# EAGLE design rj45-2x5 (EAGLE 6.5.0)
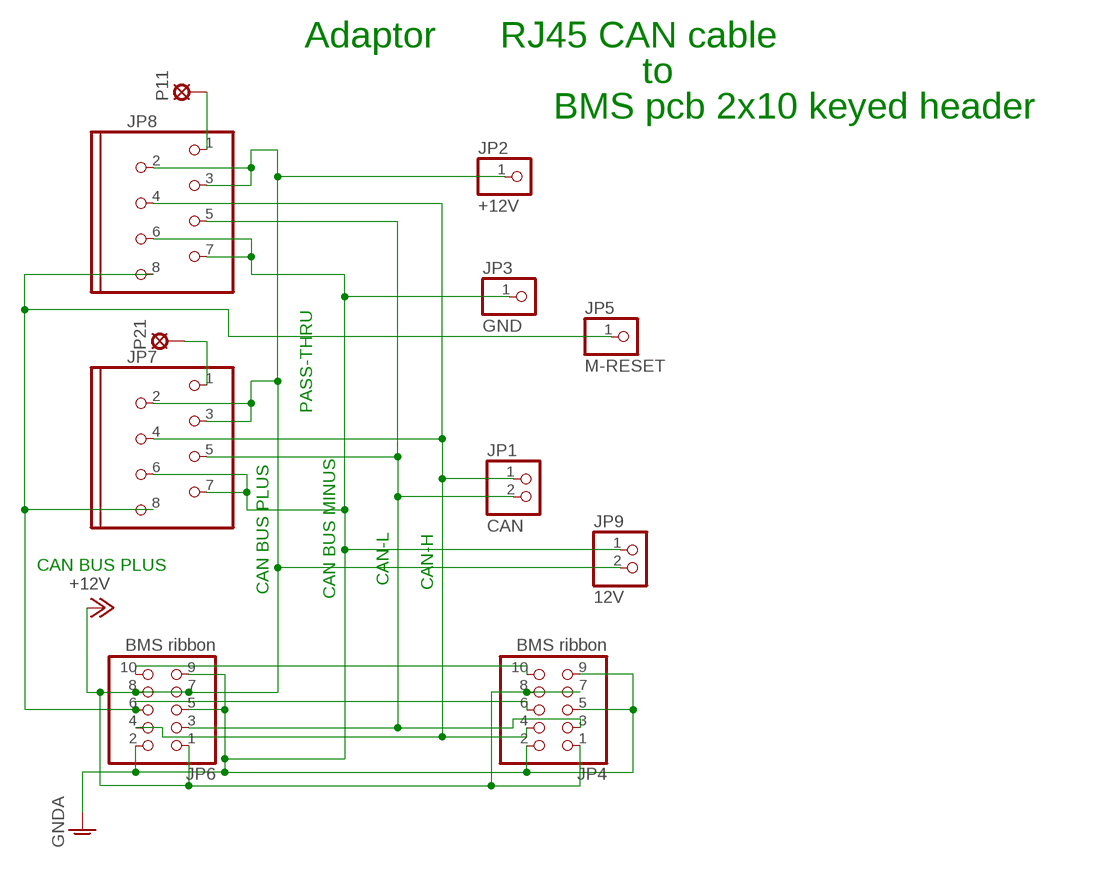
[diagram p0: schematic, sheet 1]

## Parts
JP1  CAN  PINHD-1X2  [1X02]
JP2  +12V  PINHD-1X1  [1X01]
JP3  GND  PINHD-1X1  [1X01]
JP4  BMS ribbon  PINHD-2X5_KEYED  [2X05_KEYED]
JP5  M-RESET  PINHD-1X1  [1X01]
JP6  BMS ribbon  PINHD-2X5_KEYED  [2X05_KEYED]
JP7  MOD8P8C  [MOD8P8C]
JP8  MOD8P8C  [MOD8P8C]
JP9  12V  PINHD-1X2  [1X02]
P11  SOLPAD035  [SOLDPAD035]
P21  SOLPAD035  [SOLDPAD035]

## Nets
+12V: JP2.1 JP4.1 JP4.7 JP4.8 JP6.1 JP6.7 JP6.8 JP7.2 JP7.3 JP8.2 JP8.3 JP9.2
CANCABLE_1_1: JP8.1 P11.MP
CANCABLE_2_1: JP7.1 P21.MP
CANH: JP1.1 JP4.4 JP6.4 JP7.4 JP8.4
CANL: JP1.2 JP4.3 JP6.3 JP7.5 JP8.5
GNDA: JP3.1 JP4.2 JP4.5 JP4.9 JP6.2 JP6.5 JP6.9 JP7.6 JP7.7 JP8.6 JP8.7 JP9.1
MASTER-RESET-SYS: JP4.6 JP5.1 JP6.6 JP7.8 JP8.8
N$2: JP4.10 JP6.10

## Notes on the sheet
- Adaptor | RJ45 CAN cable
- to
- BMS pcb 2x10 keyed header
- PASS-THRU
- CAN BUS PLUS
- CAN-L | CAN-H
- CAN BUS PLUS | CAN BUS MINUS

## Library data of the parts
JP1 JP9 = pinhead:PINHD-1X2: PIN HEADER
JP2 JP3 JP5 = pinhead:PINHD-1X1: PIN HEADER
JP4 JP6 = pinhead:PINHD-2X5_KEYED
JP7 JP8 = DEH:MOD8P8C
P11 P21 = solpad:SOLPAD035

## Board
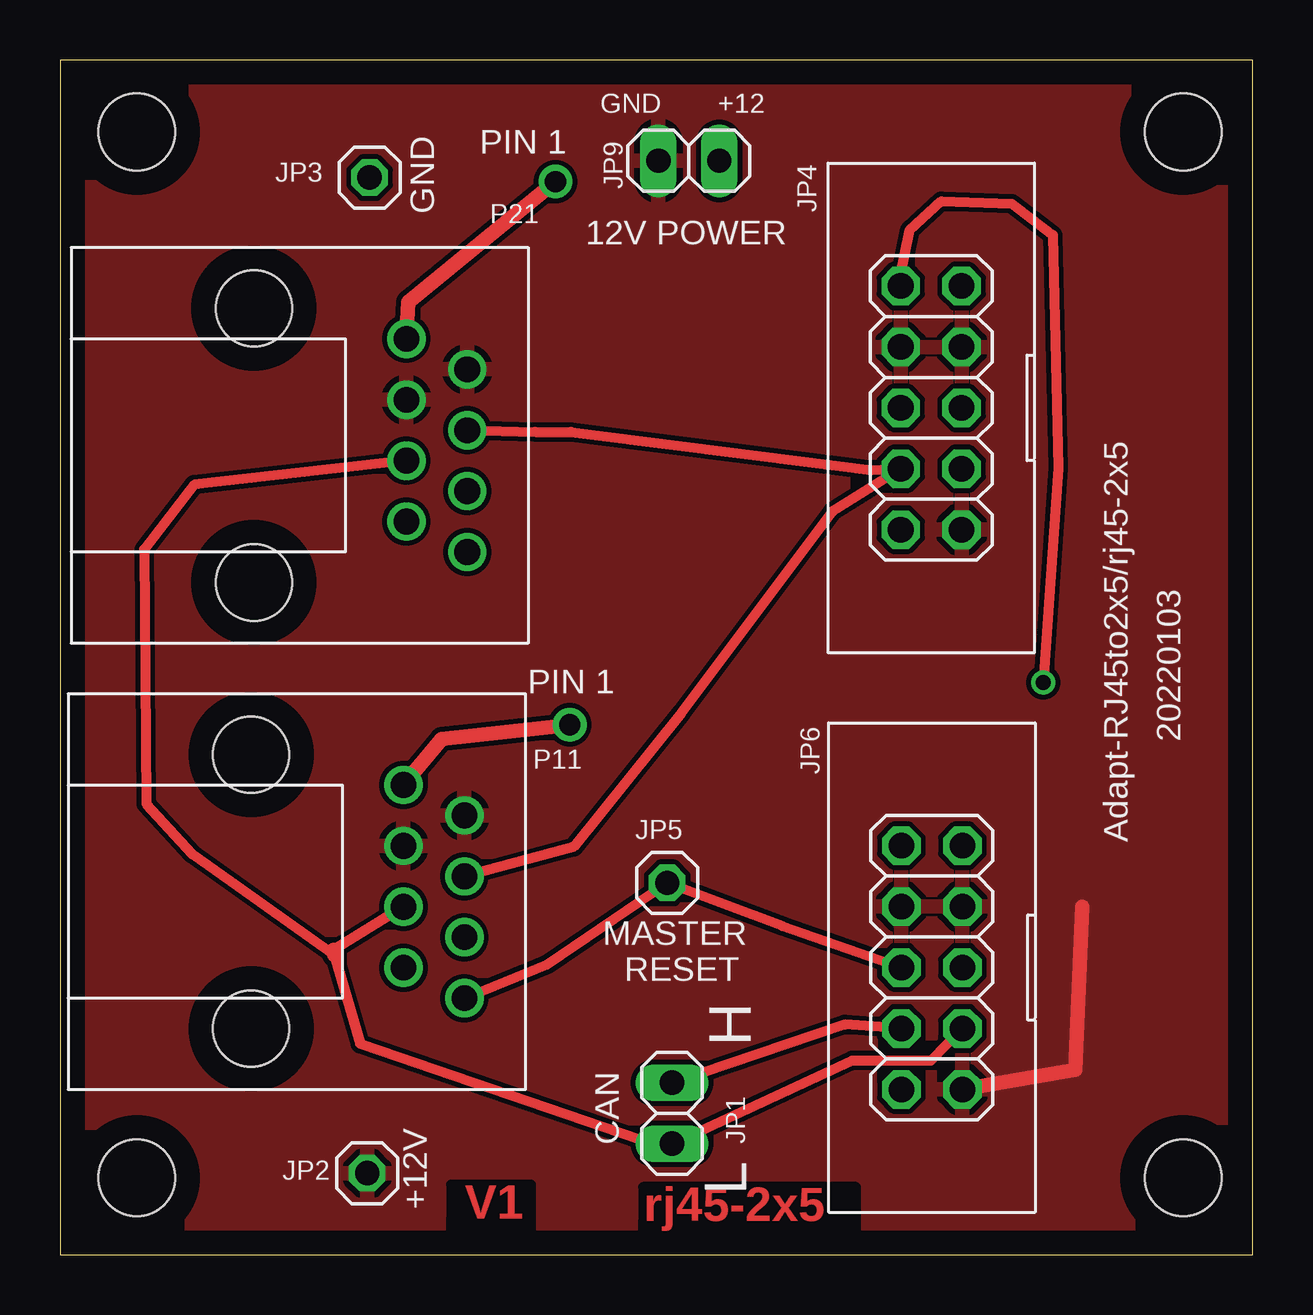
[diagram p1: board, top side]
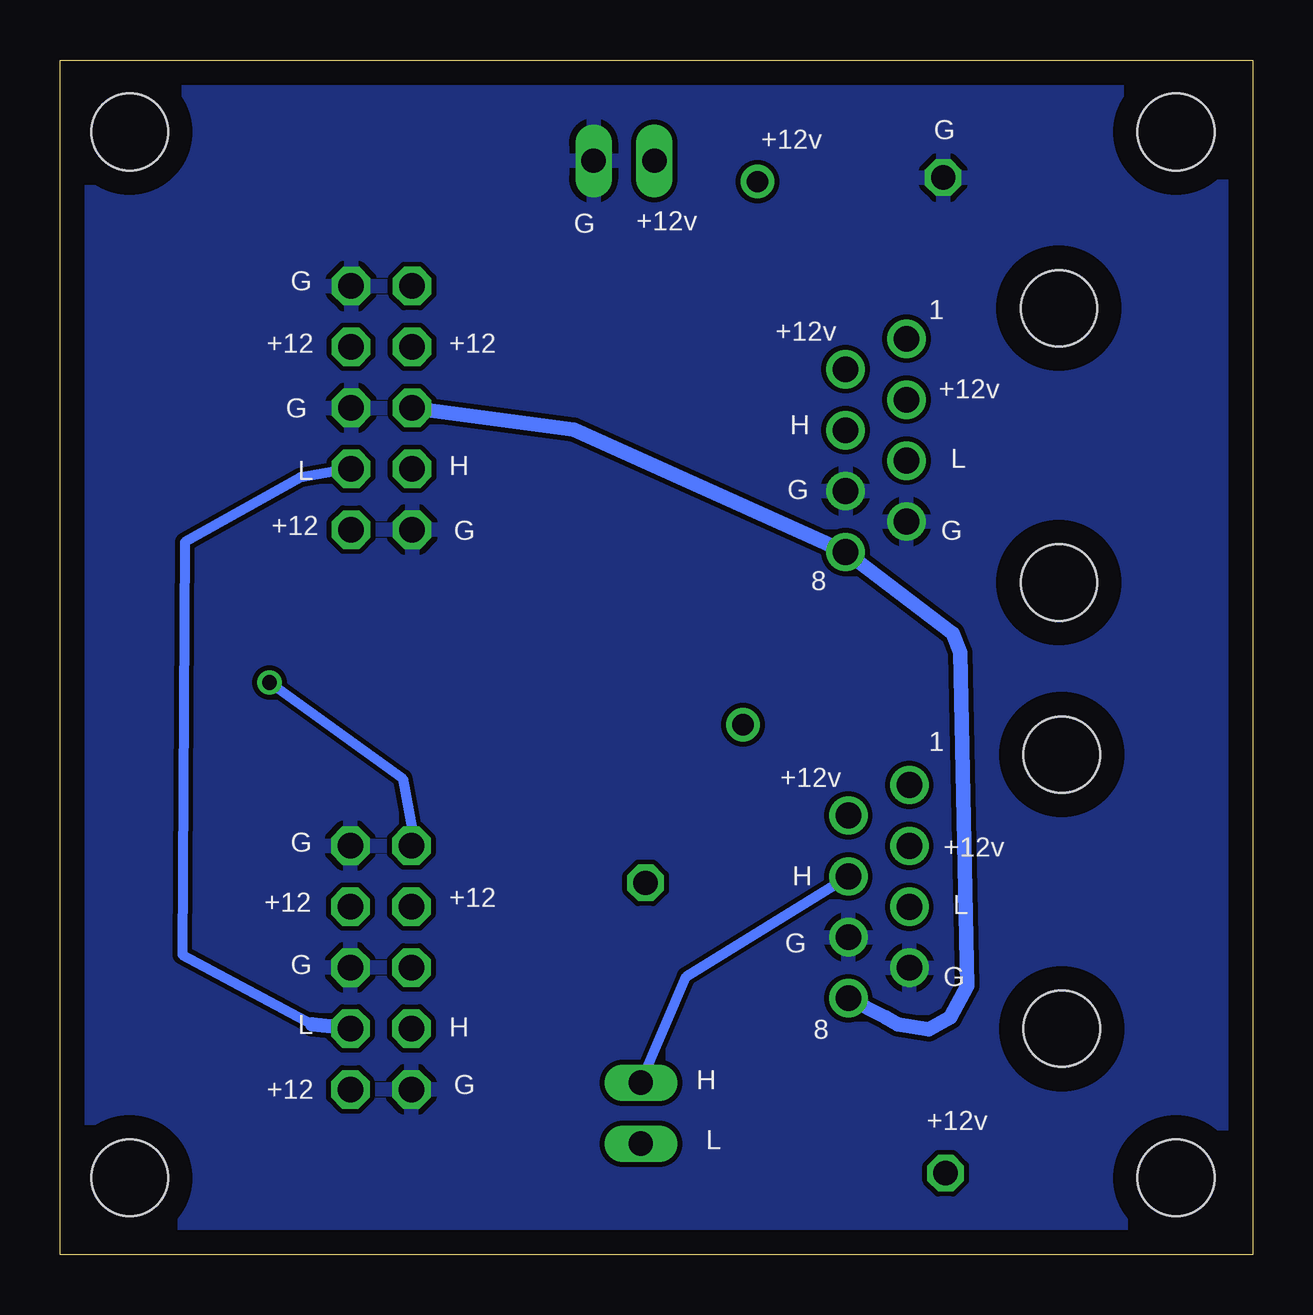
[diagram p2: board, bottom side, seen from below]

Size 49.7 x 49.8 mm. Coordinates in mm from the lower left corner, seen from the top.
Outline: 0,0 49.7,0 49.7,49.8 0,49.8 0,0
Copper layers (1*16): Top 0.035mm / dielectric 1.5mm / Bottom 0.035mm
Design rules "default *": minimum track width 10mil, minimum drill 24mil, track to track 8mil, track to pad 8mil, pad to pad 8mil, via to via 8mil, smd to smd 0mil, copper to edge 40mil, drill to drill 8mil, minimum pad ring 10mil, minimum via ring 8mil, stop-mask expansion 4mil, vias tented up to drill 0mil, thermal gap 10mil
Holes 3.2 mm at 3.2,3.2 3.2,46.8 46.8,46.8 46.8,3.2

### Footprints (pad centres in the part's own frame; a part is rotated, then mirrored left to right if it is on the bottom)
1X02 = drill 1.016 long: 1 -1.27,0; 2 1.27,0
1X01 = drill 1.016 octagon: 1 0,0
2X05_KEYED = drill 1.067 octagon: 1 -5.08,-1.27; 2 -5.08,1.27; 3 -2.54,-1.27; 4 -2.54,1.27; 5 0,-1.27; 6 0,1.27; 7 2.54,-1.27; 8 2.54,1.27; 9 5.08,-1.27; 10 5.08,1.27
MOD8P8C = drill 1.067 pad 1.397: 1 -3.81,-2.54; 2 -2.54,0; 3 -1.27,-2.54; 4 0,0; 5 1.27,-2.54; 6 2.54,0; 7 3.81,-2.54; 8 5.08,0 | hole 3.175: -5.08,-8.89; 6.35,-8.89
SOLDPAD035 = drill 0.889 pad 1.27: MP 0,0

### Placement (x,y rotation side)
JP1  25.5,5.9 270 top
JP2  12.8,3.4 0 top
JP3  12.9,44.9 0 top
JP4  36.3,35.3 90 top
JP5  25.3,15.5 0 top
JP6  36.33,11.97 90 top
JP7  16.97,34.37 270 top
JP8  16.85,15.77 270 top
JP9  26.2,45.6 180 top
P11  21.24,22.09 0 top
P21  20.64,44.73 0 top

### Tracks (layer width: path | path; a pad name or v marks a point on that pad's centre or on a via)
+12V
  Top 0.61: JP6.1 42.3,7.7 42.6,14.5
  pour Top: -3.3,51.6 17.4,52.4 52.4,52.3 52,-2.8 14.1,-3 -2.4,-3
CANCABLE_1_1
  Top 0.61: JP8.1 15.9,21.5 P11.MP
CANCABLE_2_1
  Top 0.61: JP7.1 14.5,39.7 P21.MP
CANH
  Top 0.406: JP7.4 19.8,34.3 21.3,34.3 33.8,32.7 JP4.4 32.2,31 25.9,22.6 21.4,17 JP8.4 | JP6.4 32.7,9.6 JP1.1
  Bottom 0.406: JP1.1 23.6,11.6 JP8.4
CANL
  Top 0.406: JP8.5 11.4,12.7 | JP7.5 5.6,32.1 3.5,29.4 3.6,18.8 5.5,16.7 11.44,12.51 12.5,8.8 24.2,4.8 24.2,4.5 JP1.2 33,8.1 36.3,8.1 JP6.3
  Top 0.61: 11.4,12.7 11.44,12.51
  Bottom 0.406: JP4.3 39.7,32.4 44.5,29.7 44.6,12.5 39.2,9.6
  Bottom 0.61: 39.2,9.6 JP6.3
GNDA
  pour Bottom: 16.3,51.4 51.5,51.4 50.8,-1.7 -1,-2 -1.4,51.5
MASTER-RESET-SYS
  Top 0.406: JP8.8 20.3,12.1 JP5.1 30.1,13.7 JP6.6
  Bottom 0.61: JP8.8 15.3,9.9 14.8,9.6 13.5,9.4 12.6,9.9 11.9,11.2 12.2,25.1 12.5,25.9 JP7.8 28.3,34.4 JP4.6
N$2  (via drill 0.61)
  Top 0.254: 35.02,40.77 JP4.10
  Top 0.406: v40.97,23.85 41.6,32.8 41.37,42.5 39.66,43.81 36.72,43.91 35.4,42.7 35.02,40.77
  Bottom 0.254: 35.02,17.71 JP6.10
  Bottom 0.406: 35.02,17.71 35.42,19.85 v40.97,23.85

### Text on the board
Top: V1 | rj45-2x5
tNames: GND | +12 | PIN 1 | GND | 12V POWER | PIN 1 | 20220103 | Adapt-RJ45to2x5/rj45-2x5 | MASTER | RESET | H | CAN | +12V | L
bNames: G | +12v | +12v | G | G | 1 | +12v | +12 | +12 | +12v | G | H | L | G | H | L | G | G | +12 | 8 | 1 | +12v | +12v | G | H | L | +12 | +12 | G | G | G | 8 | H | L | H | G | +12 | +12v | L